# EAGLE design alimentaçãorobozito (EAGLE 9.6.2)
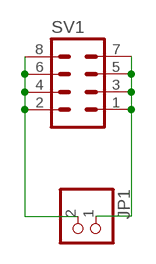
[diagram p0: schematic, sheet 1]

## Parts
JP1  PINHD-1X2  [1X02]
SV1  MA04-2  [MA04-2]

## Nets
N$1: JP1.1 SV1.1 SV1.3 SV1.5 SV1.7
N$2: JP1.2 SV1.2 SV1.4 SV1.6 SV1.8

## Library data of the parts
JP1 = pinhead:PINHD-1X2: PIN HEADER
SV1 = con-lstb:MA04-2: PIN HEADER; OC_FARNELL: unknown; OC_NEWARK: unknown

## Board
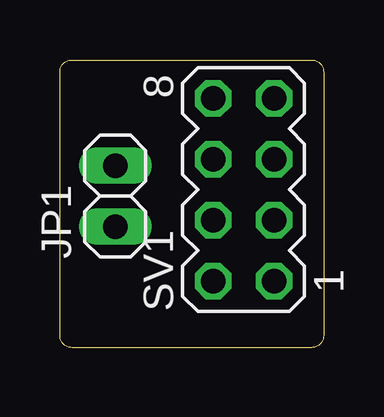
[diagram p1: board, top side]
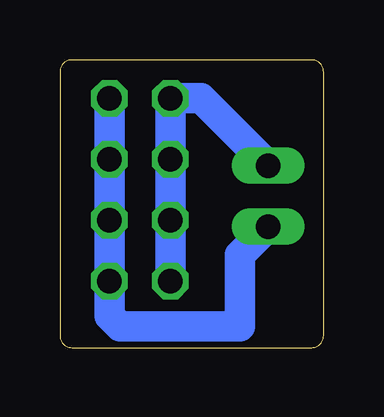
[diagram p2: board, bottom side, seen from below]

Size 11 x 12 mm. Coordinates in mm from the lower left corner, seen from the top.
Outline: 0,11.5 arc-90 0.5,12 10.5,12 arc-90 11,11.5 11,0.5 arc-90 10.5,0 0.5,0 arc-90 0,0.5 0,11.5
Copper layers (1*16): Top 0.035mm / dielectric 1.5mm / Bottom 0.035mm
Design rules "default": minimum track width 6mil, minimum drill 0.35mm, track to track 6mil, track to pad 6mil, pad to pad 6mil, via to via 6mil, smd to smd 6mil, copper to edge 40mil, drill to drill 6mil, minimum pad ring 10mil, minimum via ring 8mil, stop-mask expansion 4mil, vias tented up to drill 0mil, thermal gap 10mil

### Footprints (pad centres in the part's own frame; a part is rotated, then mirrored left to right if it is on the bottom)
1X02 = drill 1.016 long: 1 -1.27,0; 2 1.27,0
MA04-2 = drill 1.016 octagon: 1 -3.81,-1.27; 2 -3.81,1.27; 3 -1.27,-1.27; 4 -1.27,1.27; 5 1.27,-1.27; 6 1.27,1.27; 7 3.81,-1.27; 8 3.81,1.27

### Placement (x,y rotation side)
JP1  2.31,6.32 90 top
SV1  7.66,6.59 90 top

### Tracks (layer width: path | path; a pad name or v marks a point on that pad's centre or on a via)
N$1
  Bottom 1.27: JP1.1 3.5,3.86 3.5,0.89 8.5,0.89 8.93,1.32 SV1.1 SV1.3 SV1.5 SV1.7
N$2
  Bottom 1.27: JP1.2 5.12,10.4 SV1.8 SV1.6 SV1.4 SV1.2